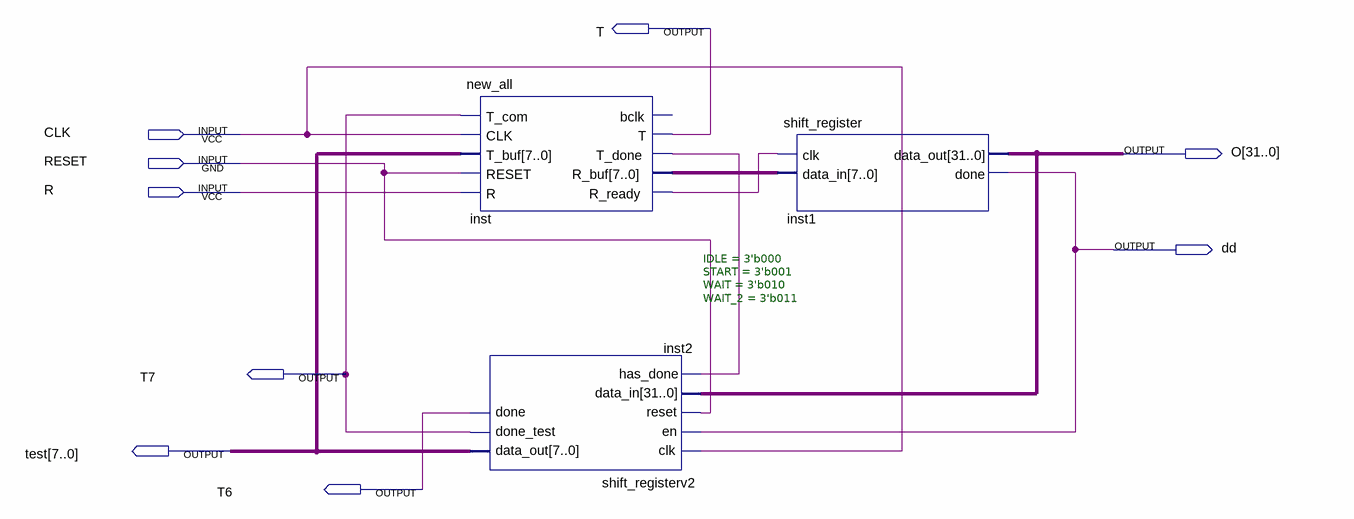
[diagram p0: schematic sheet]
// Quartus schematic next_five.bdf as structural Verilog: 3 symbols, 9 pins
module next_five (
  input  CLK,
  input  RESET,
  input  R,
  output T,
  output [31:0] O,
  output dd,
  output T7,
  output [7:0] test,
  output T6
);

  wire inst_r_ready, inst_t_done;
  wire [7:0] inst_r_buf;

  new_all inst (
    .T_com(T7), .CLK(CLK), .T_buf(test), .RESET(RESET), .R(R), .T(T), .T_done(inst_t_done),
    .R_buf(inst_r_buf), .R_ready(inst_r_ready));  // open: bclk
  shift_registerv2 #(.IDLE(3'b000), .START(3'b001), .WAIT(3'b010), .WAIT_2(3'b011)) inst2 (
    .clk(CLK), .en(dd), .reset(RESET), .data_in(O), .has_done(inst_t_done), .data_out(test), .done_test(T7),
    .done(T6));
  shift_register inst1 (.clk(inst_r_ready), .data_in(inst_r_buf), .data_out(O), .done(dd));
endmodule
